# EAGLE design Backplane_extRefV2 (EAGLE 6.6.0)
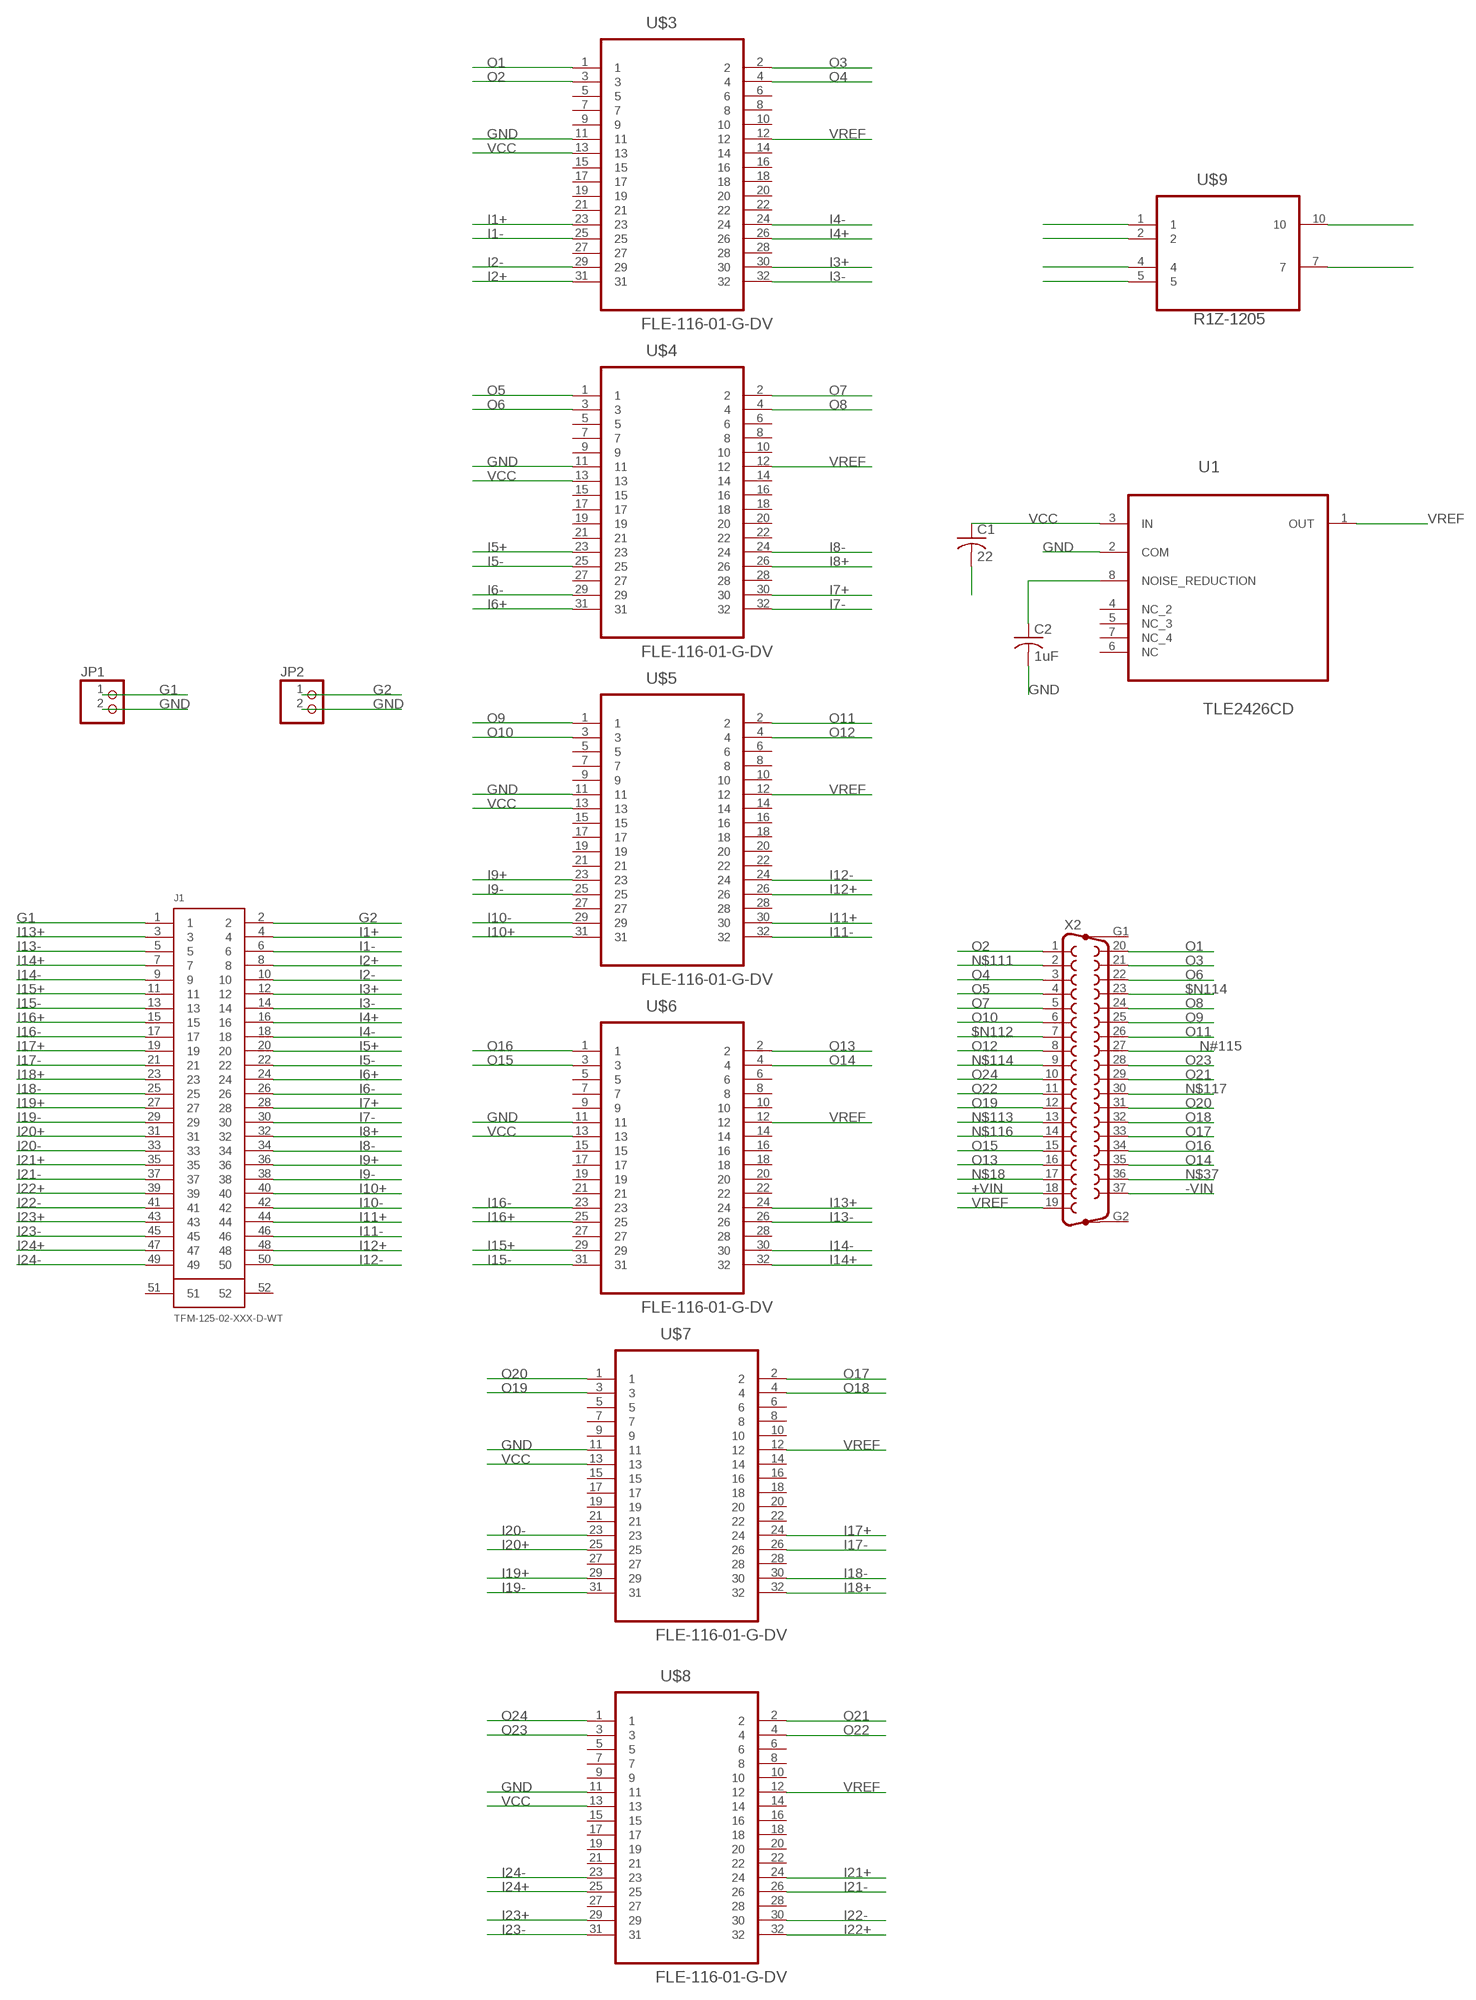
[diagram p0: schematic, sheet 1]

## Parts
C1  22  C-USC0805  [C0805]
C2  1uF  C-USC0805  [C0805]
J1  TFM-125-02-XXX-D-WT  [TFM-125-02-XXX-D-WT]
JP1  PINHD-1X2  [1X02]
JP2  PINHD-1X2  [1X02]
U1  TLE2426CD  [SOIC127P600X175-8N]
U$3  FLE-116-01-G-DV  [SAMTEC_FLE-116-01-G-DV]
U$4  FLE-116-01-G-DV  [SAMTEC_FLE-116-01-G-DV]
U$5  FLE-116-01-G-DV  [SAMTEC_FLE-116-01-G-DV]
U$6  FLE-116-01-G-DV  [SAMTEC_FLE-116-01-G-DV]
U$7  FLE-116-01-G-DV  [SAMTEC_FLE-116-01-G-DV]
U$8  FLE-116-01-G-DV  [SAMTEC_FLE-116-01-G-DV]
U$9  R1Z-1205  [R1Z-1205]
X2  F37HP  [F37HP]

## Nets
$N112: X2.7
$N114: X2.23
+VIN: U$9.2 X2.18
-VIN: U$9.1 X2.37
G1: J1.1 JP1.1
G2: J1.2 JP2.1
GND: C1.2 C2.2 JP1.2 JP2.2 U1.2(COM) U$3.11 U$4.11 U$5.11 U$6.11 U$7.11 U$8.11 U$9.4 U$9.5
I1+: J1.4 U$3.23
I1-: J1.6 U$3.25
I2+: J1.8 U$3.31
I2-: J1.10 U$3.29
I3+: J1.12 U$3.30
I3-: J1.14 U$3.32
I4+: J1.16 U$3.26
I4-: J1.18 U$3.24
I5+: J1.20 U$4.23
I5-: J1.22 U$4.25
I6+: J1.24 U$4.31
I6-: J1.26 U$4.29
I7+: J1.28 U$4.30
I7-: J1.30 U$4.32
I8+: J1.32 U$4.26
I8-: J1.34 U$4.24
I9+: J1.36 U$5.23
I9-: J1.38 U$5.25
I10+: J1.40 U$5.31
I10-: J1.42 U$5.29
I11+: J1.44 U$5.30
I11-: J1.46 U$5.32
I12+: J1.48 U$5.26
I12-: J1.50 U$5.24
I13+: J1.3 U$6.24
I13-: J1.5 U$6.26
I14+: J1.7 U$6.32
I14-: J1.9 U$6.30
I15+: J1.11 U$6.29
I15-: J1.13 U$6.31
I16+: J1.15 U$6.25
I16-: J1.17 U$6.23
I17+: J1.19 U$7.24
I17-: J1.21 U$7.26
I18+: J1.23 U$7.32
I18-: J1.25 U$7.30
I19+: J1.27 U$7.29
I19-: J1.29 U$7.31
I20+: J1.31 U$7.25
I20-: J1.33 U$7.23
I21+: J1.35 U$8.24
I21-: J1.37 U$8.26
I22+: J1.39 U$8.32
I22-: J1.41 U$8.30
I23+: J1.43 U$8.29
I23-: J1.45 U$8.31
I24+: J1.47 U$8.25
I24-: J1.49 U$8.23
N#115: X2.27
N$2: C2.1 U1.8(NOISE_REDUCTION)
N$18: X2.17
N$37: X2.36
N$111: X2.2
N$113: X2.13
N$114: X2.9
N$116: X2.14
N$117: X2.30
NC2: U$9.10
O1: U$3.1 X2.20
O2: U$3.3 X2.1
O3: U$3.2 X2.21
O4: U$3.4 X2.3
O5: U$4.1 X2.4
O6: U$4.3 X2.22
O7: U$4.2 X2.5
O8: U$4.4 X2.24
O9: U$5.1 X2.25
O10: U$5.3 X2.6
O11: U$5.2 X2.26
O12: U$5.4 X2.8
O13: U$6.2 X2.16
O14: U$6.4 X2.35
O15: U$6.3 X2.15
O16: U$6.1 X2.34
O17: U$7.2 X2.33
O18: U$7.4 X2.32
O19: U$7.3 X2.12
O20: U$7.1 X2.31
O21: U$8.2 X2.29
O22: U$8.4 X2.11
O23: U$8.3 X2.28
O24: U$8.1 X2.10
VCC: C1.1 U1.3(IN) U$3.13 U$4.13 U$5.13 U$6.13 U$7.13 U$8.13 U$9.7
VREF: U1.1(OUT) U$3.12 U$4.12 U$5.12 U$6.12 U$7.12 U$8.12 X2.19
Unconnected: J1.51 J1.52 U1.4(NC_2) U1.5(NC_3) U1.6(NC) U1.7(NC_4) U$3.5 U$3.6 U$3.7 U$3.8 U$3.9 U$3.10 U$3.14 U$3.15 U$3.16 U$3.17 U$3.18 U$3.19 U$3.20 U$3.21 U$3.22 U$3.27 U$3.28 U$4.5 U$4.6 U$4.7 U$4.8 U$4.9 U$4.10 U$4.14 U$4.15 U$4.16 U$4.17 U$4.18 U$4.19 U$4.20 U$4.21 U$4.22 U$4.27 U$4.28 U$5.5 U$5.6 U$5.7 U$5.8 U$5.9 U$5.10 U$5.14 U$5.15 U$5.16 U$5.17 U$5.18 U$5.19 U$5.20 U$5.21 U$5.22 U$5.27 U$5.28 U$6.5 U$6.6 U$6.7 U$6.8 U$6.9 U$6.10 U$6.14 U$6.15 U$6.16 U$6.17 U$6.18 U$6.19 U$6.20 U$6.21 U$6.22 U$6.27 U$6.28 U$7.5 U$7.6 U$7.7 U$7.8 U$7.9 U$7.10 U$7.14 U$7.15 U$7.16 U$7.17 U$7.18 U$7.19 U$7.20 U$7.21 U$7.22 U$7.27 U$7.28 U$8.5 U$8.6 U$8.7 U$8.8 U$8.9 U$8.10 U$8.14 U$8.15 U$8.16 U$8.17 U$8.18 U$8.19 U$8.20 U$8.21 U$8.22 U$8.27 U$8.28 X2.G1 X2.G2

## Library data of the parts
C1 C2 = rcl:C-US: CAPACITOR, American symbol
J1 = TFM-125-02-XXX-D-WT:TFM-125-02-XXX-D-WT: 0.050"X0.050" SURFACE MOUNT TERMINAL STRIP WITH DUAL WELD TAB.
JP1 JP2 = pinhead:PINHD-1X2: PIN HEADER
U1 = Texas Instruments_By_element14_Batch_1:TLE2426CD: PRECISION VIRTUAL GROUND; MPN: TLE2426CD; OC_FARNELL: 8454809; OC_NEWARK: 50B7917; PACKAGE: SOIC-8; SUPPLIER: Texas Instruments
U$3-U$8 = SAMTEC-FLE-Mxx-Sxx_By_element14_Batch_1:FLE-116-01-G-DV: CONN SOCKET, 1.27MM, SMT, 32WAY; MPN: FLE-116-01-G-DV; OC_FARNELL: 1931219; OC_NEWARK: -; PACKAGE: SOCKET, 1.27MM, SMT, 32WAY; SUPPLIER: Samtec
U$9 = tuckerLib:R1Z-1205
X2 = con-subd:F37HP: SUB-D; OC_FARNELL: unknown; OC_NEWARK: unknown

## Board
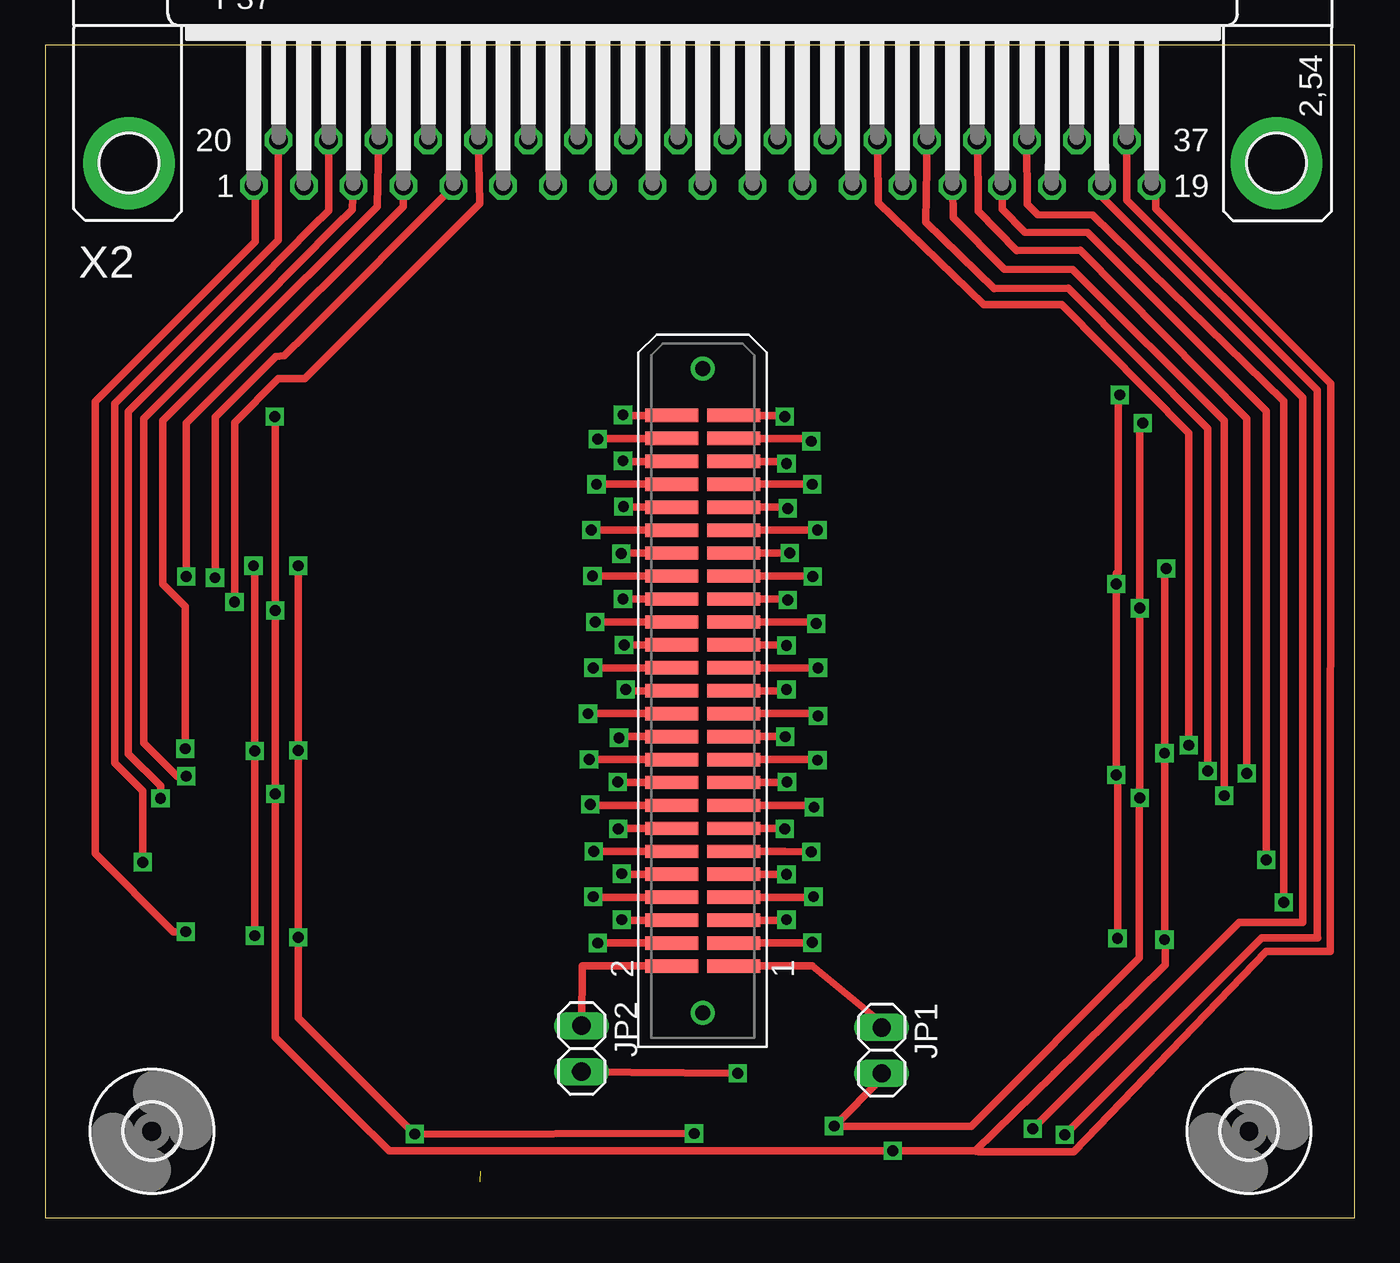
[diagram p1: board, top side]
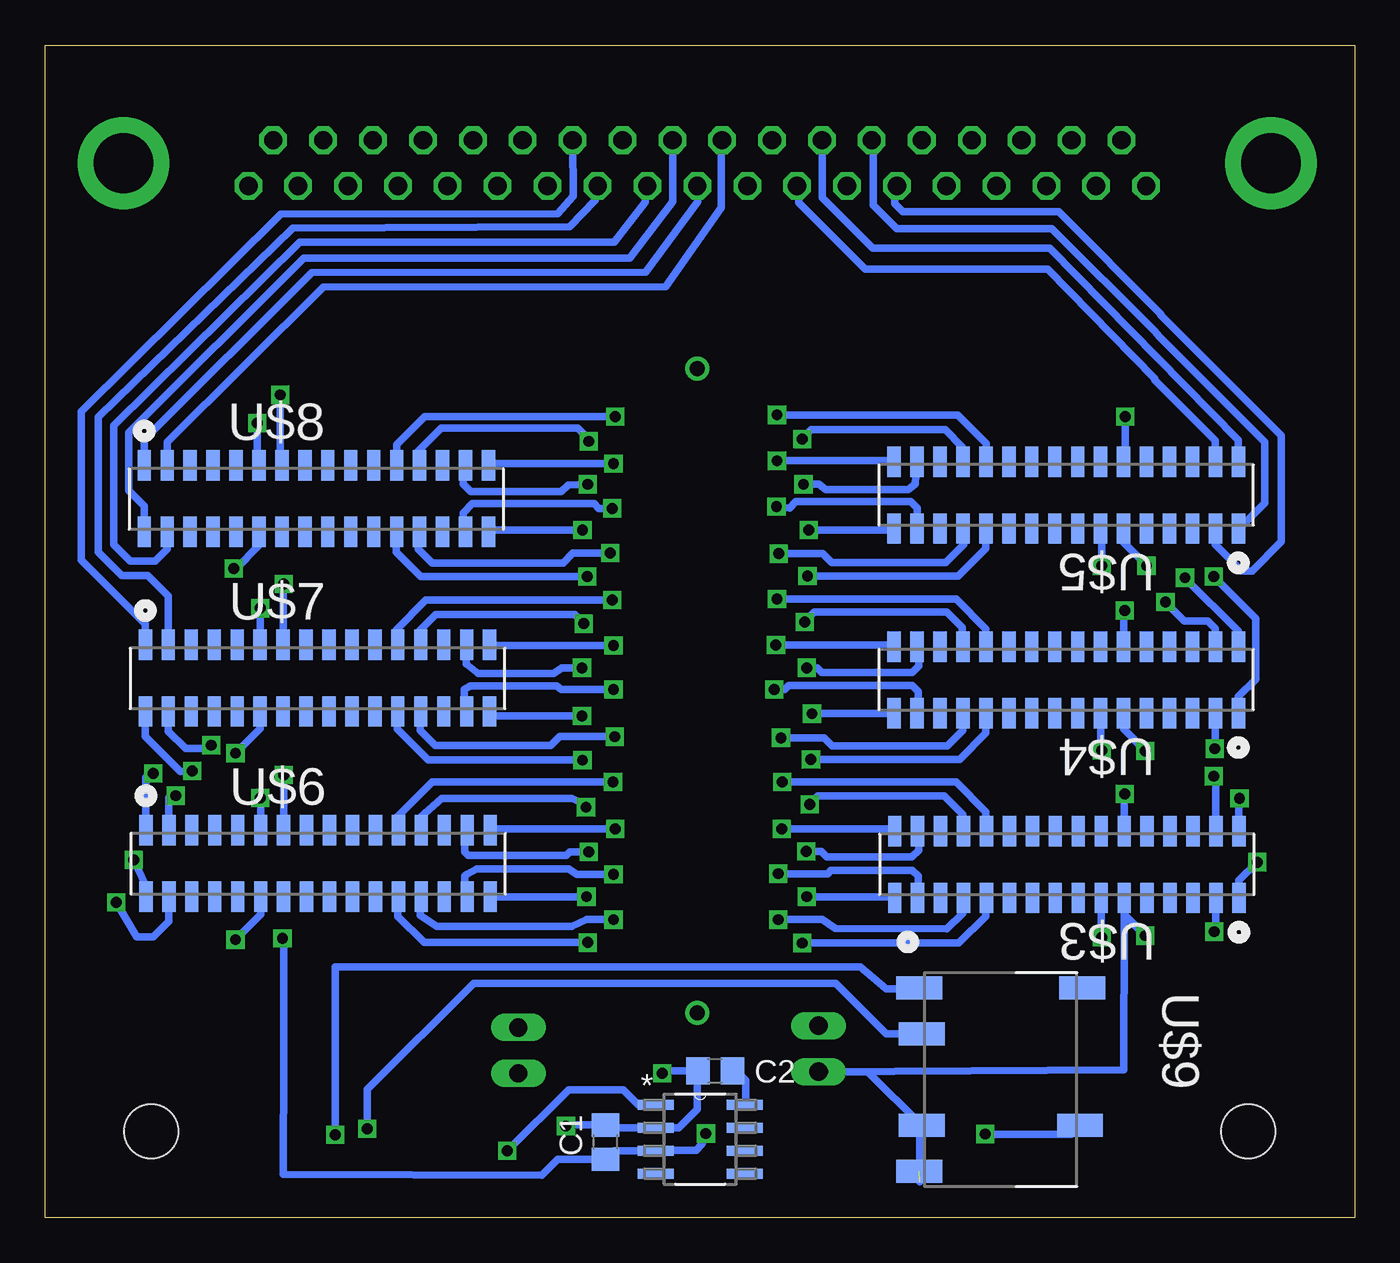
[diagram p2: board, bottom side, seen from below]

Size 72.47 x 64.92 mm. Coordinates in mm from the lower left corner, seen from the top.
Outline: 0,0 72.47,0 72.47,64.92 0,64.92 0,0
Copper layers (1*16): Top 0.035mm / dielectric 1.5mm / Bottom 0.035mm
Design rules "default *": minimum track width 10mil, minimum drill 10mil, track to track 8mil, track to pad 8mil, pad to pad 8mil, via to via 8mil, smd to smd 8mil, copper to edge 40mil, drill to drill 8mil, minimum pad ring 10mil, minimum via ring 8mil, stop-mask expansion 4mil, vias tented up to drill 0mil, thermal gap 10mil

### Footprints (pad centres in the part's own frame; a part is rotated, then mirrored left to right if it is on the bottom)
C0805 = smd 1.3 x 1.5: 1 -0.95,0; 2 0.95,0
TFM-125-02-XXX-D-WT = smd 0.737 x 2.921: 1 -15.24,-1.714; 2 -15.24,1.714; 3 -13.97,-1.714; 4 -13.97,1.714; 5 -12.7,-1.714; 6 -12.7,1.714; 7 -11.43,-1.714; 8 -11.43,1.714; 9 -10.16,-1.714; 10 -10.16,1.714; 11 -8.89,-1.714; 12 -8.89,1.714; 13 -7.62,-1.714; 14 -7.62,1.714; 15 -6.35,-1.714; 16 -6.35,1.714; 17 -5.08,-1.714; 18 -5.08,1.714; 19 -3.81,-1.714; 20 -3.81,1.714; 21 -2.54,-1.714; 22 -2.54,1.714; 23 -1.27,-1.714; 24 -1.27,1.714; 25 0,-1.714; 26 0,1.714; 27 1.27,-1.714; 28 1.27,1.714; 29 2.54,-1.714; 30 2.54,1.714; 31 3.81,-1.714; 32 3.81,1.714; 33 5.08,-1.714; 34 5.08,1.714; 35 6.35,-1.714; 36 6.35,1.714; 37 7.62,-1.714; 38 7.62,1.714; 39 8.89,-1.714; 40 8.89,1.714; 41 10.16,-1.714; 42 10.16,1.714; 43 11.43,-1.714; 44 11.43,1.714; 45 12.7,-1.714; 46 12.7,1.714; 47 13.97,-1.714; 48 13.97,1.714; 49 15.24,-1.714; 50 15.24,1.714 | drill 0.838: 51 -17.831,0; 52 17.831,0
1X02 = drill 1.016 long: 1 -1.27,0; 2 1.27,0
SOIC127P600X175-8N = smd 1.981 x 0.559: 1 -2.464,1.905; 2 -2.464,0.635; 3 -2.464,-0.635; 4 -2.464,-1.905; 5 2.464,-1.905; 6 2.464,-0.635; 7 2.464,0.635; 8 2.464,1.905
3,0 = hole 3: 0,0
SAMTEC_FLE-116-01-G-DV = smd 0.737 x 1.676: 1 -19.05,3.683; 2 -19.05,0; 3 -17.78,3.683; 4 -17.78,0; 5 -16.51,3.683; 6 -16.51,0; 7 -15.24,3.683; 8 -15.24,0; 9 -13.97,3.683; 10 -13.97,0; 11 -12.7,3.683; 12 -12.7,0; 13 -11.43,3.683; 14 -11.43,0; 15 -10.16,3.683; 16 -10.16,0; 17 -8.89,3.683; 18 -8.89,0; 19 -7.62,3.683; 20 -7.62,0; 21 -6.35,3.683; 22 -6.35,0; 23 -5.08,3.683; 24 -5.08,0; 25 -3.81,3.683; 26 -3.81,0; 27 -2.54,3.683; 28 -2.54,0; 29 -1.27,3.683; 30 -1.27,0; 31 0,3.683; 32 0,0
R1Z-1205 = smd 1.27 x 2.54: 1 -5.08,-5.207; 2 -2.54,-5.08; 4 2.54,-5.08; 5 5.08,-5.207; 7 2.54,3.683; 10 -5.08,3.81
F37HP = drill 1.016 octagon: 1 -24.841,-1.27; 2 -22.073,-1.27; 3 -19.329,-1.27; 4 -16.561,-1.27; 5 -13.792,-1.27; 6 -11.049,-1.27; 7 -8.28,-1.27; 8 -5.512,-1.27; 9 -2.769,-1.27; 10 0,-1.27; 11 2.769,-1.27; 12 5.512,-1.27; 13 8.28,-1.27; 14 11.049,-1.27; 15 13.818,-1.27; 16 16.561,-1.27; 17 19.329,-1.27; 18 22.098,-1.27; 19 24.841,-1.27; 20 -23.47,1.27; 21 -20.701,1.27; 22 -17.932,1.27; 23 -15.189,1.27; 24 -12.421,1.27; 25 -9.652,1.27; 26 -6.909,1.27; 27 -4.14,1.27; 28 -1.372,1.27; 29 1.372,1.27; 30 4.14,1.27; 31 6.909,1.27; 32 9.677,1.27; 33 12.421,1.27; 34 15.189,1.27; 35 17.958,1.27; 36 20.701,1.27; 37 23.47,1.27 | drill 3.302 pad 5.08: G1 -31.75,0; G2 31.75,0

### Placement (x,y rotation side)
C1  41.47,4.19 90 bottom
C2  35.4,8.13 180 bottom
J1  36.39,29.18 90 top
JP1  46.29,9.27 270 top
JP2  29.69,9.37 270 top
U1  36.23,4.35 0 bottom
U$1  [3,0]  66.61,4.79 0 top
U$2  [3,0]  5.91,4.79 0 top
U$3  25.46,21.4 180 bottom
U$4  25.5,31.62 180 bottom
U$5  25.5,41.85 180 bottom
U$6  47.85,17.78 0 bottom
U$7  47.88,28.04 0 bottom
U$8  47.94,37.97 0 bottom
U$9  18.89,7.65 270 bottom
X2  36.39,58.39 0 top

### Tracks (layer width: path | path; a pad name or v marks a point on that pad's centre or on a via)
+VIN  (via drill 0.6)
  Top 0.406: X2.18 58.48,56.52 69.6,45.4 69.6,16.35 66.07,16.35 v54.64,4.92
  Bottom 0.406: v54.64,4.92 54.64,7.11 48.77,12.99 28.73,12.99 25.94,10.19 U$9.2
-VIN  (via drill 0.6)
  Top 0.406: X2.37 59.86,56.35 70.39,45.81 70.39,15.53 70.42,15.49 67.31,15.49 v56.42,4.6
  Bottom 0.406: v56.42,4.6 56.42,13.91 27.37,13.91 25.94,12.67 24.16,12.67 U$9.1
G1
  Top 0.406: J1.1 42.45,13.94 46.48,10.64 46.45,10.54 JP1.1
G2
  Top 0.406: J1.2 29.72,13.94 JP2.1
GND  (via drill 0.6)  (1 unrouted)
  Top 0.406: v11.59,15.62 v11.59,25.84 11.59,36.04 v11.53,36.1 | v60.74,44.01 60.58,43.85 v60.58,33.75 v60.58,23.24 60.55,23.21 60.55,14.38 51.24,5.08 v43.66,5.08 46.29,7.71 JP1.2 | v38.32,8 v29.43,8.1 JP2.2
  Bottom 0.406: U$3.11 12.76,16.8 | 12.76,16.8 v11.59,15.62 | v11.53,36.1 12.83,37.4 12.83,38.13 U$5.11 | U$4.11 12.8,27.05 v11.59,25.84 | 12.76,16.8 12.76,16.57 12.8,8.19 JP2.2 | U$6.11 60.55,23.21 v60.58,23.24 | v60.74,44.01 60.74,41.75 U$8.11 | U$7.11 v60.58,33.75 | v43.66,5.08 43.6,5.14 C1.2 41.31,4.99 U1.2 37.4,4.99 36.39,6 36.39,8.09 C2.2 38.61,8.13 v38.32,8 | 24.07,2 24.07,5.11 U$9.4 26.96,8.1 v29.43,8.1
I1+  (via drill 0.6)
  Top 0.406: J1.4 v30.58,15.21
  Bottom 0.406: v30.58,15.21 21.91,15.21 20.42,16.7 20.42,17.68 U$3.23
I1-  (via drill 0.6)
  Top 0.406: J1.6 31.94,16.48 v31.91,16.51
  Bottom 0.406: v31.91,16.51 29.46,16.51 28.77,16.03 22.57,16 21.69,16.86 21.69,17.68 U$3.25
I2+  (via drill 0.6)
  Top 0.406: J1.8 30.35,17.75 v30.32,17.78
  Bottom 0.406: v30.32,17.78 25.53,17.78 U$3.31
I2-  (via drill 0.6)
  Top 0.406: J1.10 31.94,19.02 v31.91,19.05
  Bottom 0.406: U$3.29 24.16,17.75 24.16,18.92 24.48,19.24 28.99,19.24 29.18,19.05 v31.91,19.05
I3+  (via drill 0.6)
  Top 0.406: J1.12 v30.35,20.29
  Bottom 0.406: U$3.30 24.13,21.34 24.13,20.35 24.51,19.97 29.21,19.97 29.53,20.29 v30.35,20.29
I3-  (via drill 0.6)
  Top 0.406: J1.14 31.75,21.56 v31.72,21.53
  Bottom 0.406: v31.72,21.53 25.59,21.53 U$3.32
I4+  (via drill 0.6)
  Top 0.406: J1.16 30.23,22.83 v30.16,22.89
  Bottom 0.406: v30.16,22.89 30.16,22.92 29.72,23.37 22.73,23.37 21.69,22.32 21.69,21.43 U$3.26
I4-  (via drill 0.6)
  Top 0.406: J1.18 31.72,24.1 v31.69,24.13
  Bottom 0.406: v31.69,24.13 22.07,24.13 20.42,22.48 20.42,21.43 U$3.24
I5+  (via drill 0.6)
  Top 0.406: J1.20 v30.1,25.37
  Bottom 0.406: v30.1,25.37 21.88,25.37 20.42,26.83 U$4.23
I5-  (via drill 0.6)
  Top 0.406: J1.22 31.81,26.64 v31.75,26.57
  Bottom 0.406: v31.75,26.57 29.37,26.57 28.92,26.13 22.54,26.13 21.69,26.99 U$4.25
I6+  (via drill 0.6)
  Top 0.406: J1.24 v30.04,27.91
  Bottom 0.406: v30.04,27.91 25.53,27.91 U$4.31
I6-  (via drill 0.6)
  Top 0.406: J1.26 32.19,29.18 v32.13,29.24
  Bottom 0.406: U$4.29 24.16,28 24.16,29.15 24.26,29.24 24.48,29.46 31.34,29.46 31.56,29.24 v32.13,29.24
I7+  (via drill 0.6)
  Top 0.406: J1.28 v30.32,30.45
  Bottom 0.406: U$4.30 24.13,31.53 24.13,30.54 24.48,30.19 29.5,30.19 29.75,30.45 v30.32,30.45
I7-  (via drill 0.6)
  Top 0.406: J1.30 v32.04,31.72
  Bottom 0.406: v32.04,31.72 25.59,31.72 U$4.32
I8+  (via drill 0.6)
  Top 0.406: J1.32 v30.45,32.99
  Bottom 0.406: v30.45,32.99 29.91,33.53 22.57,33.53 21.72,32.67 21.72,31.66 U$4.26
I8-  (via drill 0.6)
  Top 0.406: J1.34 v31.97,34.26
  Bottom 0.406: v31.97,34.26 22.07,34.26 20.42,32.61 U$4.24
I9+  (via drill 0.6)
  Top 0.406: J1.36 v30.29,35.53
  Bottom 0.406: v30.29,35.53 21.94,35.53 20.42,37.05 U$5.23
I9-  (via drill 0.6)
  Top 0.406: J1.38 31.91,36.8 v31.88,36.77
  Bottom 0.406: v31.88,36.77 29.43,36.77 28.96,36.29 22.64,36.29 21.65,37.27 21.65,38.13 U$5.25
I10+  (via drill 0.6)
  Top 0.406: J1.40 v30.23,38.07
  Bottom 0.406: v30.23,38.07 25.59,38.07 U$5.31
I10-  (via drill 0.6)
  Top 0.406: J1.42 32.42,39.34 v32,39.37
  Bottom 0.406: U$5.29 24.23,39.31 24.57,39.66 30.92,39.66 31.27,39.31 v32,39.37
I11+  (via drill 0.6)
  Top 0.406: J1.44 v30.51,40.61
  Bottom 0.406: U$5.30 24.26,42.35 24.26,41.5 24.32,40.61 24.7,40.32 29.27,40.32 29.65,40.61 v30.51,40.61
I11-  (via drill 0.6)
  Top 0.406: J1.46 32,41.88 v31.97,41.91
  Bottom 0.406: v31.97,41.91 25.56,41.91 U$5.32
I12+  (via drill 0.6)
  Top 0.406: J1.48 30.61,43.15 v30.58,43.12
  Bottom 0.406: v30.58,43.12 30.07,43.62 22.67,43.62 21.72,42.67 21.72,41.88 U$5.26
I12-  (via drill 0.6)
  Top 0.406: J1.50 32,44.42 v31.97,44.45
  Bottom 0.406: v31.97,44.45 21.97,44.45 20.38,42.86 20.38,41.88 U$5.24
I13+  (via drill 0.6)
  Top 0.406: J1.3 42.42,15.21 v42.45,15.24
  Bottom 0.406: v42.45,15.24 51.5,15.24 52.96,16.7 52.96,17.75 U$6.24
I13-  (via drill 0.6)
  Top 0.406: J1.5 40.99,16.48 v41.02,16.51
  Bottom 0.406: v41.02,16.51 42.51,16.51 43.34,16.13 50.8,16.13 51.72,16.73 51.72,17.72 U$6.26
I14+  (via drill 0.6)
  Top 0.406: J1.7 42.48,17.75 v42.51,17.78
  Bottom 0.406: v42.51,17.78 U$6.32
I14-  (via drill 0.6)
  Top 0.406: J1.9 v41.02,19.02
  Bottom 0.406: U$6.30 49.24,18.16 49.24,18.92 49.15,19.02 48.58,19.3 43.5,19.3 43.05,19.02 v41.02,19.02
I15+  (via drill 0.6)
  Top 0.406: J1.11 40.93,20.29 v42.39,20.26
  Bottom 0.406: U$6.29 49.18,21.65 49.18,21.18 49.24,21.11 49.24,20.26 49.05,20.07 43.62,20.07 43.43,20.26 v42.39,20.26
I15-  (via drill 0.6)
  Top 0.406: J1.13 40.89,21.56 v40.93,21.53
  Bottom 0.406: v40.93,21.53 47.78,21.53 U$6.31
I16+  (via drill 0.6)
  Top 0.406: J1.15 42.45,22.83 v42.54,22.73
  Bottom 0.406: v42.54,22.73 42.54,22.89 43.34,23.21 50.51,23.21 51.72,22.16 51.72,21.53 U$6.25
I16-  (via drill 0.6)
  Top 0.406: J1.17 41.02,24.1 v41.05,24.13
  Bottom 0.406: v41.05,24.13 51.05,24.13 52.96,22.23 52.96,21.5 U$6.23
I17+  (via drill 0.6)
  Top 0.406: J1.19 42.7,25.37 v42.74,25.34
  Bottom 0.406: v42.74,25.34 51.28,25.34 52.99,27.05 52.99,28 U$7.24
I17-  (via drill 0.6)
  Top 0.406: J1.21 v40.96,26.64
  Bottom 0.406: v40.96,26.64 44.01,26.64 44.48,26.16 50.9,26.16 51.72,26.99 51.72,28 U$7.26
I18+  (via drill 0.6)
  Top 0.406: J1.23 42.64,27.91 v42.77,27.78
  Bottom 0.406: v42.77,27.78 47.62,27.78 U$7.32
I18-  (via drill 0.6)
  Top 0.406: J1.25 40.93,29.18 v41.02,29.24
  Bottom 0.406: U$7.30 49.28,28.64 49.28,29.24 48.96,29.43 44.16,29.43 43.91,29.24 v41.02,29.24
I19+  (via drill 0.6)
  Top 0.406: J1.27 v42.77,30.45
  Bottom 0.406: U$7.29 49.18,32.16 49.18,30.67 48.51,30.13 44.32,30.13 43.88,30.45 v42.77,30.45
I19-  (via drill 0.6)
  Top 0.406: J1.29 40.99,31.72 v41.02,31.69
  Bottom 0.406: v41.02,31.69 47.85,31.69 U$7.31
I20+  (via drill 0.6)
  Top 0.406: J1.31 42.58,32.99 v42.67,32.89
  Bottom 0.406: v42.67,32.89 43.18,33.4 50.86,33.4 51.75,32.51 51.75,31.78 U$7.25
I20-  (via drill 0.6)
  Top 0.406: J1.33 41.02,34.26 v41.08,34.2
  Bottom 0.406: v41.08,34.2 51.4,34.2 53.05,32.54 53.05,31.81 U$7.23
I21+  (via drill 0.6)
  Top 0.406: J1.35 42.45,35.53 v42.48,35.5
  Bottom 0.406: v42.48,35.5 51.69,35.5 53.05,36.86 53.05,37.94 U$8.24
I21-  (via drill 0.6)
  Top 0.406: J1.37 v41.21,36.8
  Bottom 0.406: v41.21,36.8 43.28,36.8 43.82,36.26 51.05,36.26 51.82,37.02 51.82,37.91 U$8.26
I22+  (via drill 0.6)
  Top 0.406: J1.39 v42.74,38.07
  Bottom 0.406: v42.74,38.07 47.85,38.07 U$8.32
I22-  (via drill 0.6)
  Top 0.406: J1.41 41.02,39.34 v41.08,39.27
  Bottom 0.406: U$8.30 49.34,38.1 49.34,39.02 48.83,39.53 42.1,39.53 41.85,39.27 v41.08,39.27
I23+  (via drill 0.6)
  Top 0.406: J1.43 v42.45,40.61
  Bottom 0.406: U$8.29 49.34,41.53 49.34,40.61 48.93,40.2 43.91,40.2 43.53,40.58 v42.45,40.61
I23-  (via drill 0.6)
  Top 0.406: J1.45 40.89,41.88 v41.02,41.75
  Bottom 0.406: v41.02,41.75 47.85,41.75 U$8.31
I24+  (via drill 0.6)
  Top 0.406: J1.47 42.23,43.15 v42.39,42.99
  Bottom 0.406: v42.39,42.99 42.39,43.12 42.99,43.72 50.55,43.72 51.82,42.45 51.82,41.72 U$8.25
I24-  (via drill 0.6)
  Top 0.406: J1.49 40.86,44.42 v40.93,44.35
  Bottom 0.406: v40.93,44.35 51.47,44.35 53.02,42.8 U$8.23
N$2
  Bottom 0.406: C2.1 34.26,8.16 33.72,7.62 33.72,6.3 U1.8
O1  (via drill 0.6)
  Top 0.406: v5.4,19.68 5.4,23.62 3.84,25.18 3.84,45.09 12.89,54.13 12.89,59.63 X2.20
  Bottom 0.406: U$3.1 6.41,18.67 v5.4,19.68
O2  (via drill 0.6)
  Top 0.406: v7.78,15.84 7.08,15.84 2.76,20.16 2.76,45.18 11.62,54.04 11.62,57.04 X2.1
  Bottom 0.406: U$3.3 7.68,15.94 v7.78,15.84
O3  (via drill 0.6)
  Top 0.406: v6.38,23.21 6.38,23.91 4.6,25.69 4.6,44.64 11.94,51.98 14.76,54.83 15.68,55.75 X2.21
  Bottom 0.406: U$3.2 6.41,23.18 v6.38,23.21
O4  (via drill 0.6)
  Top 0.406: v7.81,24.45 7.3,24.45 5.46,26.29 5.46,44.26 12,50.8 16.07,54.9 16.99,55.82 X2.3
  Bottom 0.406: U$3.4 7.68,24.32 v7.81,24.45
O5  (via drill 0.6)
  Top 0.406: v7.81,35.5 7.81,44.01 12.54,48.74 17.91,54.07 19.81,55.98 19.81,57.11 X2.4
  Bottom 0.406: U$4.1 6.45,28.86 5.49,29.81 5.49,33.18 v7.81,35.5
O6  (via drill 0.6)
  Top 0.406: v7.75,25.97 7.75,33.85 6.51,35.08 6.51,44.13 12.1,49.72 16.89,54.48 18.38,55.98 X2.22
  Bottom 0.406: U$4.3 7.72,26 v7.75,25.97
O7  (via drill 0.6)
  Top 0.406: v9.4,35.43 9.4,44.32 12.76,47.69 13.24,47.72 14.51,48.99 22.61,57.11 X2.5
  Bottom 0.406: U$4.2 6.45,32.48 v9.4,35.43
O8  (via drill 0.6)
  Top 0.406: v10.48,34.1 10.48,44.04 12.89,46.45 14.35,46.45 24.03,56.13 X2.24
  Bottom 0.406: U$4.4 7.72,32.64 8.13,33.05 9.43,33.05 v10.48,34.1
O9
  Bottom 0.406: U$5.1 6.38,38.16 4.98,39.56 4.98,42.96 10.79,48.77 11.11,49.12 16.76,54.77 25.34,54.77 26.64,56.07 26.64,59.56 X2.25
O10
  Top 0.406: 25.27,57.05 X2.6
  Bottom 0.406: U$5.3 7.72,37.27 6.25,35.81 5.68,35.81 4.06,37.43 4.06,43.31 10.73,49.97 10.73,50.04 16.38,55.69 25.02,55.69 25.46,56.13 25.46,56.99 X2.6 25.37,57.09
O11
  Bottom 0.406: U$5.2 6.45,43.05 16.89,53.69 26.67,53.69 29.46,56.48 29.46,59.65 X2.26 29.5,59.64
O12
  Bottom 0.406: U$5.4 7.72,43.02 11.08,46.39 11.08,46.45 16.99,52.51 27.08,52.51 30.77,56.2 30.77,57.01 X2.8 30.86,57.11
O13  (via drill 0.6)
  Top 0.406: v67.56,19.81 67.56,44.67 57.69,54.55 54.2,54.58 52.96,55.85 52.96,57.11 X2.16
  Bottom 0.406: U$6.2 66.9,18.41 v67.56,19.81
O14  (via drill 0.6)
  Top 0.406: v68.55,17.46 68.55,45.21 57.98,55.5 54.93,55.53 54.36,56.1 54.32,59.64 X2.35
  Bottom 0.406: U$6.4 65.63,16.41 66.48,15.56 67.41,15.56 v68.55,17.46
O15  (via drill 0.6)
  Top 0.406: v65.25,23.37 65.25,44.13 56.86,52.48 53.09,52.51 50.26,55.37 50.23,57.09 X2.15
  Bottom 0.406: U$6.3 65.63,23.24 v65.25,23.37
O16  (via drill 0.6)
  Top 0.406: v66.48,24.61 66.48,44.26 57.28,53.56 53.75,53.53 51.63,55.72 51.59,59.64 X2.34
  Bottom 0.406: U$6.1 66.9,24.38 v66.48,24.61
O17  (via drill 0.6)
  Top 0.406: v64.33,24.73 64.33,43.69 56.61,51.47 52.51,51.44 48.74,55.12 X2.33
  Bottom 0.406: U$7.2 66.93,26.64 64.99,24.7 64.36,24.7 v64.33,24.73
O18  (via drill 0.6)
  Top 0.406: v63.28,26.16 63.28,43.43 56.26,50.55 51.94,50.55 46.1,56.2 46.07,58.99 46.2,59.12 46.2,59.52 X2.32
  Bottom 0.406: U$7.4 65.66,26.92 64.71,25.97 63.72,25.97 v63.28,26.16
O19
  Bottom 0.406: U$7.3 65.66,34.42 66.8,35.56 68.23,35.56 69.53,36.86 69.53,44.32 58.77,54.8 43.43,54.86 42.04,56.33 41.91,57.11 X2.12
O20
  Bottom 0.406: U$7.1 66.93,32.86 70.49,36.42 70.49,44.64 59.44,55.56 44.1,55.59 43.24,56.55 43.28,59.64 X2.31
O21
  Bottom 0.406: U$8.2 66.99,39.4 67.85,40.26 67.85,43.47 58.17,53.12 40.13,53.12 37.75,56.26 X2.29
O22
  Bottom 0.406: U$8.4 65.72,37.02 66.39,36.35 67.75,36.35 68.68,37.27 68.68,43.85 58.39,54.01 40.99,54.01 39.27,56.23 39.18,57.09 X2.11
O23
  Bottom 0.406: U$8.3 65.72,42.96 57.09,51.53 38.13,51.56 35.05,55.91 35.05,59.62 X2.28
O24
  Bottom 0.406: U$8.1 66.99,43.09 57.72,52.32 39.24,52.36 36.35,56.26 X2.10
VCC  (via drill 0.6)
  Top 0.406: v14,36.1 v14,25.88 v14,15.53 14,11.08 v20.45,4.64 v35.91,4.67 | v59.47,45.56 59.37,45.47 59.37,35.75 59.28,35.66 v59.28,35.08 v59.28,24.51 59.34,24.45 v59.34,15.46
  Bottom 0.406: v14,36.1 14,38.1 U$5.13 | U$4.13 14.07,25.94 v14,25.88 | v35.91,4.67 36.16,4.03 36.45,3.75 38.66,3.75 U1.3 40.99,3.71 C1.1 44.1,3.24 44.99,2.35 59.31,2.41 59.28,9.08 59.28,15.4 v59.34,15.46 | U$6.13 v59.28,24.51 | v59.47,45.56 59.47,41.75 U$8.13 | U$7.13 59.31,35.05 v59.28,35.08 | U$3.13 14.03,15.56 v14,15.53 | v20.45,4.64 15.68,4.64 U$9.7
VREF  (via drill 0.6)
  Top 0.406: v12.7,44.35 12.73,44.32 v12.73,33.62 v12.73,23.46 12.73,10 17.02,5.71 19.05,3.71 v46.89,3.71 51.24,3.71 | v62.04,35.94 61.94,35.85 v61.94,25.72 v61.94,15.4 61.98,15.37 61.98,14 55.77,7.93 | 51.24,3.71 51.47,3.71 55.77,7.93 | X2.19 61.23,56.88 61.47,56.64 61.47,55.88 71.15,46.2 71.12,14.76 67.56,14.76 56.93,3.65 51.66,3.65 51.24,3.71 | 55.81,7.97 55.77,7.93
  Bottom 0.406: U1.1 39.66,6.25 40.48,7.08 43.5,7.08 v46.89,3.71 | v12.7,44.35 12.7,41.94 U$5.12 | U$3.12 12.76,23.43 v12.73,23.46 | U$4.12 12.8,33.56 v12.73,33.62 | U$6.12 60.55,16.8 v61.94,15.4 | v62.04,35.94 61.91,35.94 60.64,37.21 U$8.12 | U$7.12 60.58,27.08 v61.94,25.72